# Altium project BMS Slave.PrjPcb
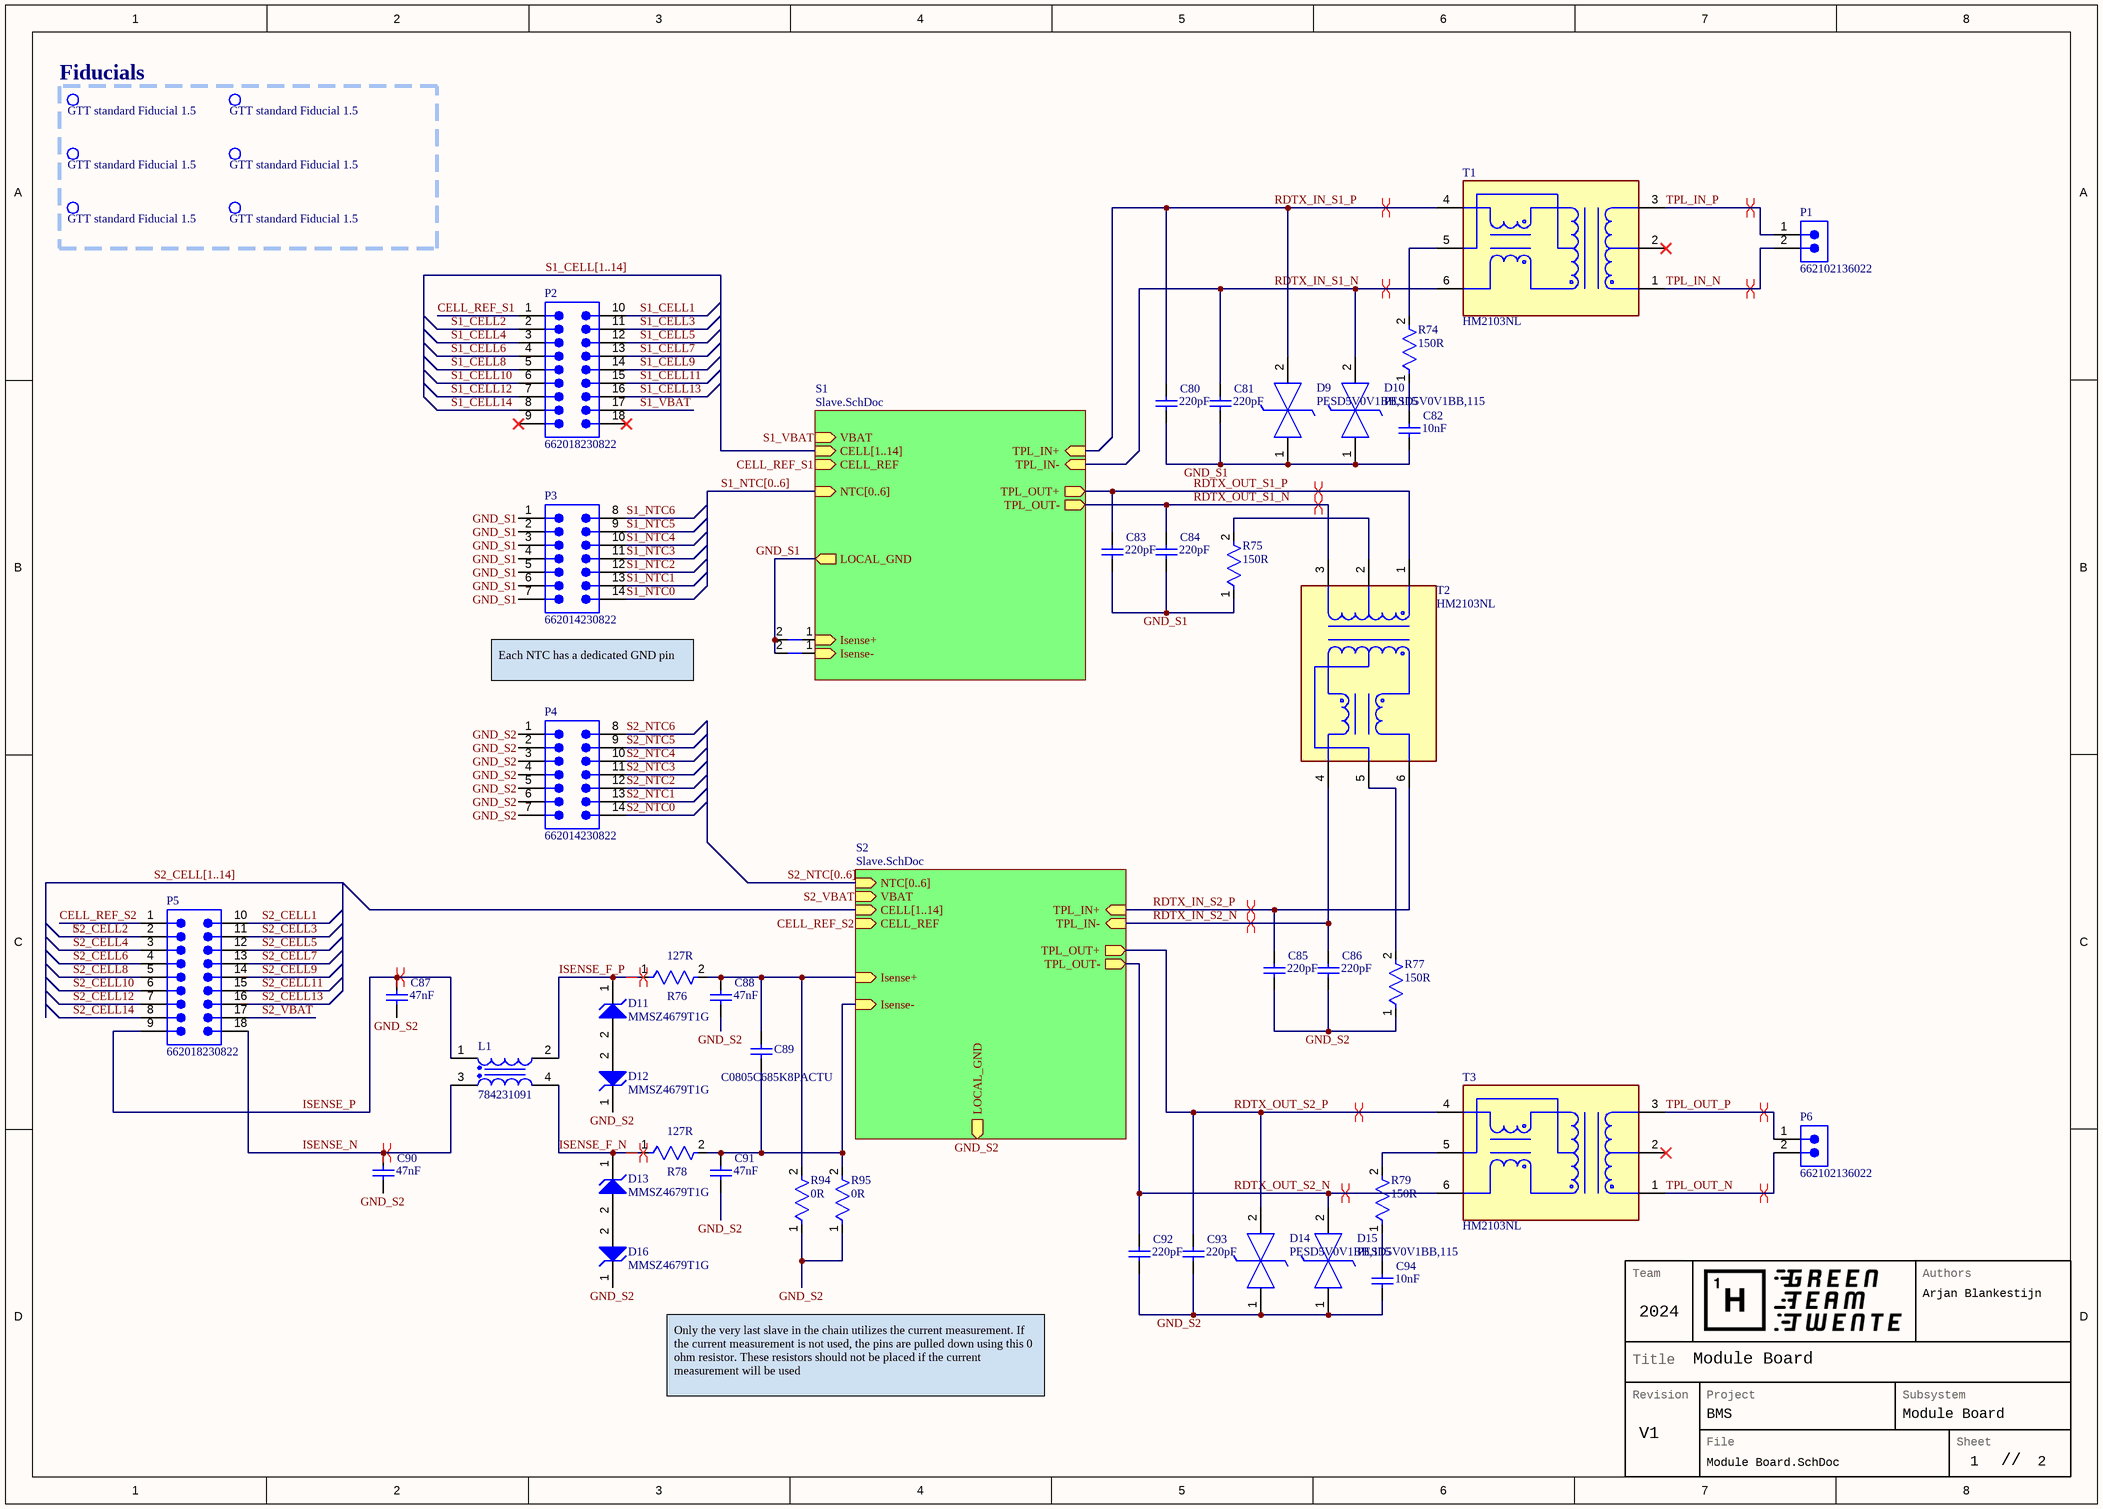
[diagram p0: Module Board.SchDoc]
2 sheets, 405 parts. Net scope: hierarchical (ports join the sheet entries above them; power ports are global).
Board file: Module Board.PcbDoc
Sheets:
  Module Board.SchDoc
    S1 = Slave.SchDoc
    S2 = Slave.SchDoc

## Sheet Module Board.SchDoc: Module Board
size A3; Author: Arjan Blankestijn; Revision: V1; SheetNumber: 1; SheetTotal: 2; Team: 2024; Subsystem: Module Board; ProjectPrettyName: BMS

### Parts
*1  GTT standard Fiducial 1.5  [Fiducial 1.5mm]  (no BOM)
*2  GTT standard Fiducial 1.5  [Fiducial 1.5mm]  (no BOM)
*3  GTT standard Fiducial 1.5  [Fiducial 1.5mm]  (no BOM)
*4  GTT standard Fiducial 1.5  [Fiducial 1.5mm]  (no BOM)
*5  GTT standard Fiducial 1.5  [Fiducial 1.5mm]  (no BOM)
*6  GTT standard Fiducial 1.5  [Fiducial 1.5mm]  (no BOM)
C80  value 220pF  [WCAP-CSGP_0402_L1W0.5H0.5]  (hidden comment: CAP 0402 220pF X7R)
C81  value 220pF  [WCAP-CSGP_0402_L1W0.5H0.5]  (hidden comment: CAP 0402 220pF X7R)
C82  value 10nF  [WCAP-CSGP_0402_L1W0.5H0.5]  (hidden comment: CAP 0402 10nF X7R)
C83  value 220pF  [WCAP-CSGP_0402_L1W0.5H0.5]  (hidden comment: CAP 0402 220pF X7R)
C84  value 220pF  [WCAP-CSGP_0402_L1W0.5H0.5]  (hidden comment: CAP 0402 220pF X7R)
C85  value 220pF  [WCAP-CSGP_0402_L1W0.5H0.5]  (hidden comment: CAP 0402 220pF X7R)
C86  value 220pF  [WCAP-CSGP_0402_L1W0.5H0.5]  (hidden comment: CAP 0402 220pF X7R)
C87  value 47nF  [WCAP-CSGP_0402_L1W0.5H0.5]  (hidden comment: CAP 0402 47nF X7R)
C88  value 47nF  [WCAP-CSGP_0402_L1W0.5H0.5]  (hidden comment: CAP 0402 47nF X7R)
C89  C0805C685K8PACTU  [CAPC2013X145X50NL20T25]
C90  value 47nF  [WCAP-CSGP_0402_L1W0.5H0.5]  (hidden comment: CAP 0402 47nF X7R)
C91  value 47nF  [WCAP-CSGP_0402_L1W0.5H0.5]  (hidden comment: CAP 0402 47nF X7R)
C92  value 220pF  [WCAP-CSGP_0402_L1W0.5H0.5]  (hidden comment: CAP 0402 220pF X7R)
C93  value 220pF  [WCAP-CSGP_0402_L1W0.5H0.5]  (hidden comment: CAP 0402 220pF X7R)
C94  value 10nF  [WCAP-CSGP_0402_L1W0.5H0.5]  (hidden comment: CAP 0402 10nF X7R)
D9  PESD5V0V1BB,115  [PESD5V0V1BB115]
D10  PESD5V0V1BB,115  [PESD5V0V1BB115]
D11  MMSZ4679T1G  [ONSC-SOD-123-2-425-04_V]
D12  MMSZ4679T1G  [ONSC-SOD-123-2-425-04_V]
D13  MMSZ4679T1G  [ONSC-SOD-123-2-425-04_V]
D14  PESD5V0V1BB,115  [PESD5V0V1BB115]
D15  PESD5V0V1BB,115  [PESD5V0V1BB115]
D16  MMSZ4679T1G  [ONSC-SOD-123-2-425-04_V]
L1  784231091  [WE-CNSA_0805]
NT1  Net Tie 0.2mm  [NETTIE_0.2mm]  (value not drawn)  (net tie, no BOM)
NT2  Net Tie 0.2mm  [NETTIE_0.2mm]  (value not drawn)  (net tie, no BOM)
P1  662102136022  [662102136022]
P2  662018230822  [662018230822]
P3  662014230822  [662014230822]
P4  662014230822  [662014230822]
P5  662018230822  [662018230822]
P6  662102136022  [662102136022]
R74  value 150R  [FP0402]  (hidden comment: RES 0402 150R 1%)
R75  value 150R  [FP0402]  (hidden comment: RES 0402 150R 1%)
R76  value 127R  [FP0402]  (hidden comment: RES 0402 127R 1%)
R77  value 150R  [FP0402]  (hidden comment: RES 0402 150R 1%)
R78  value 127R  [FP0402]  (hidden comment: RES 0402 127R 1%)
R79  value 150R  [FP0402]  (hidden comment: RES 0402 150R 1%)
R94  value 0R  [FP0402]  (hidden comment: RES 0402 0R 1%)
R95  value 0R  [FP0402]  (hidden comment: RES 0402 0R 1%)
T1  HM2103NL  [FP-HM2103NL-MFG]
T2  HM2103NL  [FP-HM2103NL-MFG]
T3  HM2103NL  [FP-HM2103NL-MFG]

### Blocks framed on the sheet
Fiducials: *1-*6

### Sub-sheets
S1 = Slave.SchDoc: CELL[1..14] (in), CELL_REF (in), LOCAL_GND (out), NTC[0..6] (in), TPL_IN+ (in), TPL_IN- (in), TPL_OUT+ (out), TPL_OUT- (out), Isense+ (in), Isense- (in), VBAT (in)
S2 = Slave.SchDoc: CELL[1..14] (in), CELL_REF (in), LOCAL_GND (out), NTC[0..6] (in), TPL_IN+ (in), TPL_IN- (in), TPL_OUT+ (out), TPL_OUT- (out), Isense+ (in), Isense- (in), VBAT (in)

### Nets
GND_S1: C80.1 C81.1 C82.1 C83.1 C84.1 C85.1 C86.1 C87.1 C88.1 C90.1 C91.1 C92.1 C93.1 C94.1 D9.1(K1) D10.1(K1) D12.1(K) D14.1(K1) D15.1(K1) D16.1(K) NT1.2 NT2.2 P3.1 P3.2 P3.3 P3.4 P3.5 P3.6 P3.7 P4.1 P4.2 P4.3 P4.4 P4.5 P4.6 P4.7 R75.1 R77.1 R94.1 R95.1 ; sheet S1/LOCAL_GND, sheet S2/LOCAL_GND  [also labelled GND_S2]
: P5.2  [also labelled S2_CELL2]
CELL_REF_S1: P2.1 ; sheet S1/CELL_REF  [project net CELL_REF]
CELL_REF_S2: P5.1 ; sheet S2/CELL_REF  [project net CELL_REF]
ISENSE_F_N: D13.1(K) L1.4 R78.1
ISENSE_F_P: D11.1(K) L1.2 R76.1
ISENSE_N: C90.2 L1.3 P5.18
ISENSE_P: C87.2 L1.1 P5.9
RDTX_IN_S1_N: C81.2 D10.2(K2) T1.6 ; sheet S1/TPL_IN-
RDTX_IN_S1_P: C80.2 D9.2(K2) T1.4 ; sheet S1/TPL_IN+
RDTX_IN_S2_N: C86.2 T2.4 ; sheet S2/TPL_IN-
RDTX_IN_S2_P: C85.2 T2.6 ; sheet S2/TPL_IN+
RDTX_OUT_S1_N: C84.2 T2.3 ; sheet S1/TPL_OUT-
RDTX_OUT_S1_P: C83.2 T2.1 ; sheet S1/TPL_OUT+
RDTX_OUT_S2_N: C92.2 D15.2(K2) T3.6 ; sheet S2/TPL_OUT-
RDTX_OUT_S2_P: C93.2 D14.2(K2) T3.4 ; sheet S2/TPL_OUT+
S1_CELL1: P2.10
S1_CELL2: P2.2
S1_CELL3: P2.11
S1_CELL4: P2.3
S1_CELL5: P2.12
S1_CELL6: P2.4
S1_CELL7: P2.13
S1_CELL8: P2.5
S1_CELL9: P2.14
S1_CELL10: P2.6
S1_CELL11: P2.15
S1_CELL12: P2.7
S1_CELL13: P2.16
S1_CELL14: P2.8
S1_NTC0: P3.14
S1_NTC1: P3.13
S1_NTC2: P3.12
S1_NTC3: P3.11
S1_NTC4: P3.10
S1_NTC5: P3.9
S1_NTC6: P3.8
S1_VBAT: P2.17 ; sheet S1/VBAT
S2_CELL1: P5.10
S2_CELL3: P5.11
S2_CELL4: P5.3
S2_CELL5: P5.12
S2_CELL6: P5.4
S2_CELL7: P5.13
S2_CELL8: P5.5
S2_CELL9: P5.14
S2_CELL10: P5.6
S2_CELL11: P5.15
S2_CELL12: P5.7
S2_CELL13: P5.16
S2_CELL14: P5.8
S2_NTC0: P4.14
S2_NTC1: P4.13
S2_NTC2: P4.12
S2_NTC3: P4.11
S2_NTC4: P4.10
S2_NTC5: P4.9
S2_NTC6: P4.8
S2_VBAT: P5.17 ; sheet S2/VBAT
TPL_IN_N: P1.2 T1.1
TPL_IN_P: P1.1 T1.3
TPL_OUT_N: P6.2 T3.1
TPL_OUT_P: P6.1 T3.3
NetC82_2: C82.2 R74.1
NetC88_2: C88.2 C89.2 R76.2 R94.2 ; sheet S2/Isense+
NetC89_1: C89.1 C91.2 R78.2 R95.2 ; sheet S2/Isense-
NetC94_2: C94.2 R79.1
NetD11_2: D11.2(A) D12.2(A)
NetD13_2: D13.2(A) D16.2(A)
NetIC1_S1_56: NT1.1 ; sheet S1/Isense+
NetIC1_S1_57: NT2.1 ; sheet S1/Isense-
NetR74_2: R74.2 T1.5
NetR75_2: R75.2 T2.2
NetR77_2: R77.2 T2.5
NetR79_2: R79.2 T3.5

Not connected (* = marked no-connect by the designer): P2 9* 18*; T1 2*; T3 2*

### Buses and harness runs
bus S1_CELL[1..14] = sheet S1/CELL[1..14]
bus S1_NTC[0..6] = sheet S1/NTC[0..6]
bus S2_CELL[1..14] = sheet S2/CELL[1..14]
bus S2_NTC[0..6] = sheet S2/NTC[0..6]

### Layout directives
differential pair; differential pair class TPL100; rule Clearance Constraint [Generic clearance = 0.15mm, and 12 value(s) for objects]: RDTX_IN_S1_N, RDTX_IN_S1_P, RDTX_IN_S2_N, RDTX_IN_S2_P, RDTX_OUT_S1_N, RDTX_OUT_S1_P, RDTX_OUT_S2_N, RDTX_OUT_S2_P, TPL_IN_N, TPL_IN_P, TPL_OUT_N, TPL_OUT_P
differential pair: ISENSE_F_N, ISENSE_F_P, ISENSE_N, ISENSE_P

### Notes on the sheet
- Each NTC has a dedicated GND pin
- Only the very last slave in the chain utilizes the current measurement. If the current measurement is not used, the pins are pulled down using this 0 ohm resistor. These resistors should not be placed if the current measurement will be used
- Team
- Authors
- Revision
- Title
- Project
- Subsystem
- File
- Sheet
- //

### Library data of the parts
*1-*6 = CMP-00028-00005-4: Fiducial 1.5; Pins: 0
C80-C88 C90-C94 = CMP-001-01308-5: GTT Standard 0402 non-polarized capacitor; Pins: 2; Case/Package: 0402; Category: Multilayer Ceramic Chip Capacitors; Ceramic Type: X7R
C89 = CMP-1036-04909-2: 6.8uF 0804; Manufacturer: Kemet; Part Number: C0805C685K8PACTU
D9 D10 D14 D15 = CMP-004-00097-1: PESD5V0V1BB - Very low capacitance bidirectional ESD protection diode; Manufacturer_Name: Nexperia; Arrow Price/Stock: https://www.arrow.com/en/products/pesd5v0v1bb115/nexperia?region=nac; Design Item ID: PESD5V0V1BB,115; Height: 0.65mm; Manufacturer_Part_Number: PESD5V0V1BB,115; Mouser Price/Stock: https://www.mouser.co.uk/ProductDetail/Nexperia/PESD5V0V1BB115?qs=GcY6OjH1zdkfLKV5vNnV%252BA%3D%3D; Datasheet Link: https://assets.nexperia.com/documents/data-sheet/PESD5V0V1BB.pdf; Mouser Part Number: 771-PESD5V0V1BB115; Source: TempSchematics.schlib; Arrow Part Number: PESD5V0V1BB,115
D11-D13 D16 = CMP-1060-00509-1: Zener Voltage Regulator, 500 mW, 2-Pin SOD-123, Pb-Free, Tape and Reel; Manufacturer: On Semiconductor; P Max (W): 0.5; VZ Typ (V): 2; Packing: Tape and Reel; ComponentLink1Description: Manufacturer URL; DatasheetVersion: Rev. 9; PackageReference: SOD-123-2-425-04; ComponentLink3URL: http://www.onsemi.com/pub_link/Collateral/425-04.PDF; PackageDescription: 2-Pin SOD, Body 1.6 x 2.69 mm; ComponentLink3Description: Package Specification; ComponentLink2Description: Datasheet; ComponentLink1URL: http://www.onsemi.com/; PartNumber: MMSZ4679T1G; RoHS: Pb-Free; PackageVersion: Rev. G, 10/2009; ComponentLink2URL: http://www.onsemi.com/pub_link/Collateral/MMSZ4678T1-D.PDF; Mounting Technology: Surface Mount
L1 = CMP-00030-00004-1: Common Mode Filter, Aec-Q200, 131Nh/0.37A Rohs Compliant: Yes
NT1 NT2 = CMP-009-00202-2
P1 P6 = CMP-1502-00472-2: NexarPartId: 71472447; Operating Supply Voltage: 250V; Insulation Resistance: 1GΩ; Contact Resistance: 10mΩ; Number of Positions: 2; Pitch: 3mm; Gender: Male; Connector Type: Male Pin; Current Rating: 5A; Lead Pitch: 3mm; Number of Pins: 2; Fastening Type: Ramp; Color: Black; Packaging: Tape and Reel; Mount: Surface Mount; Length: 9.65mm; Contact Plating: Tin; Max Operating Temperature: 105°C; RoHS: Compliant; Min Operating Temperature: -40°C; Number of Rows: 1; Termination: Solder
P2 P5 = CMP-1502-00404-2: NexarPartId: 23024748; Contact Resistance: 10mΩ; Pitch: 3mm; Number of Positions: 18; Insulation Resistance: 1GΩ; Gender: Male; Connector Type: Male Pin, Socket; Operating Supply Voltage: 250V; Current Rating: 5A; Row Spacing: 2.9972mm; RoHS: Compliant; Color: Black; Height: 11.36mm; REACH SVHC: Unknown; Contact Plating: Tin; Contact Material: Copper; Width: 30.7mm; Length: 30.7mm; Mount: Surface Mount; Termination: Solder; Max Operating Temperature: 105°C; Number of Pins: 18; Min Operating Temperature: -40°C; Lead Pitch: 3mm; Fastening Type: Ramp; Number of Rows: 2; Number of Contacts: 18
P3 P4 = CMP-1502-00402-2: NexarPartId: 23024730; Contact Resistance: 10mΩ; Connector Type: Male Pin, Socket; Gender: Male; Number of Contacts: 14; Operating Supply Voltage: 250V; Current Rating: 5A; Insulation Resistance: 1GΩ; Pitch: 3mm; Row Spacing: 2.9972mm; Height: 11.36mm; Color: Black; Contact Plating: Tin; Lead Pitch: 3mm; Number of Positions: 14; Number of Rows: 2; Min Operating Temperature: -40°C; Contact Material: Copper; Termination: Solder; REACH SVHC: Unknown; Number of Pins: 14; Max Operating Temperature: 105°C; Mount: Surface Mount; RoHS: Compliant; Fastening Type: Ramp; Length: 24.7mm; Width: 24.7mm
R74-R79 R94 R95 = CMP-009-00204-16: GTT Standard 0402 Resistor; Voltage Rating: 50V; Power: 62.5mW; Case/Package: 0402; Mounting Technology: SMD; Design Item ID: RES 0402; Source: Passives.SchLib; Tolerance: 1%
T1-T3 = CMP-16309-000039-1: XFMR CMC MODULE AECQ BATT MNGT; Obsolete Part: false; Manufacturer: Pulse; Isolation Voltage: 4300VDC; Automotive Grade: Grade 1; Turns Ratio: 1:1; Standoff Height: 0.13mm; Insertion Loss: 0.25dB; Return Loss: 20dB; Inductance Primary: 150uH; Device Class L2: Transformers; Automotive: Yes; RoHS: TRUE; Device Class L1: Passive Components; Digikey Description: XFMR CMC MODULE AECQ BATT MNGT; Package: 0; Manufacturer Part Number: HM2103NL; Height: 5.72mm; Temperature Range High: +125°C; Temperature Range Low: -40°C; Category: Trans; Temperature: -40°C to +125°C; Lead Free: Yes; ComponentLink2URL: https://productfinder.pulseeng.com/product/HM2103NL; Octopart: https://octopart.com/hm2103nl-pulse-87646222; Device Class L3: unset; ComponentLink2Description: Datasheet

## Sheet Slave.SchDoc: Slave
size A3; Author: Arjan Blankestijn; Revision: V1; SheetNumber: 2; SheetTotal: 2; Author2: Bram Bremer; Team: 2024; ProjectPrettyName: BMS; Subsystem: Module Board
Used 2 times, as channels S1, S2. Parts and nets are listed once, with the designators drawn on the sheet.
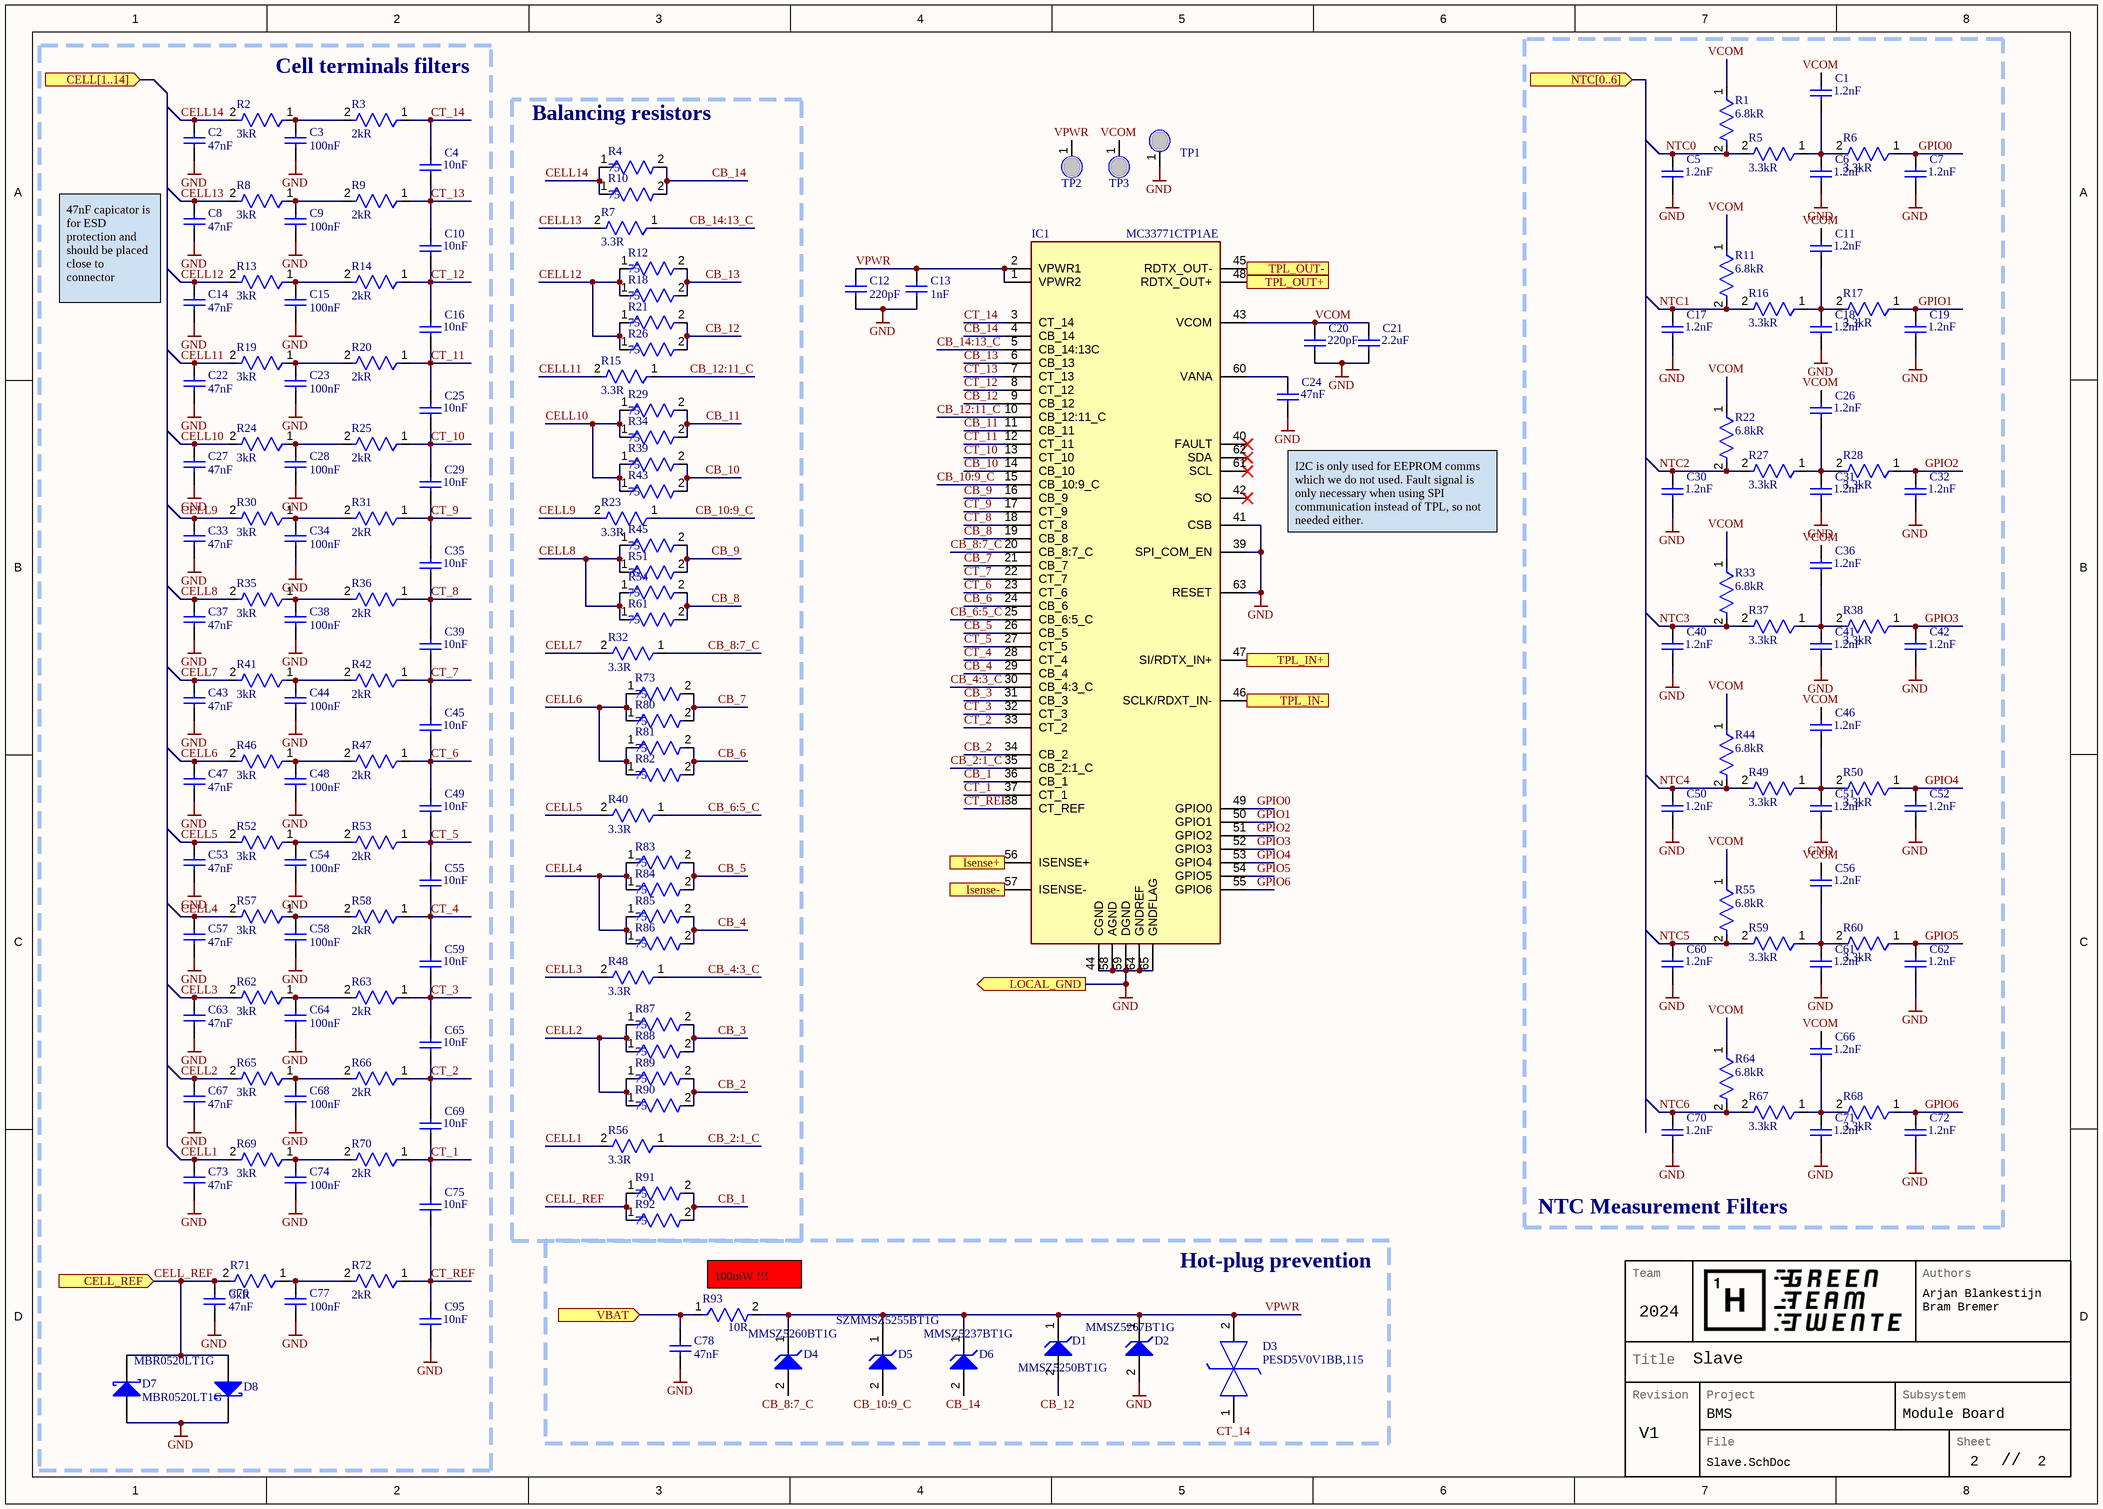
[diagram p1: Slave.SchDoc]

### Parts
C1  value 1.2nF  [WCAP-CSGP_0402_L1W0.5H0.5]  (hidden comment: CAP 0402 1.2nF X7R)
C2  value 47nF  [WCAP-CSGP_0603_L1.6W0.8H0.8_Reflow]  (hidden comment: CAP 0603 47nF X7R)
C3  value 100nF  [WCAP-CSGP_0603_L1.6W0.8H0.8_Reflow]  (hidden comment: CAP 0603 100nF X7R)
C4  value 10nF  [WCAP-CSGP_0402_L1W0.5H0.5]  (hidden comment: CAP 0402 10nF X7R)
C5  value 1.2nF  [WCAP-CSGP_0402_L1W0.5H0.5]  (hidden comment: CAP 0402 1.2nF X7R)
C6  value 1.2nF  [WCAP-CSGP_0402_L1W0.5H0.5]  (hidden comment: CAP 0402 1.2nF X7R)
C7  value 1.2nF  [WCAP-CSGP_0402_L1W0.5H0.5]  (hidden comment: CAP 0402 1.2nF X7R)
C8  value 47nF  [WCAP-CSGP_0603_L1.6W0.8H0.8_Reflow]  (hidden comment: CAP 0603 47nF X7R)
C9  value 100nF  [WCAP-CSGP_0603_L1.6W0.8H0.8_Reflow]  (hidden comment: CAP 0603 100nF X7R)
C10  value 10nF  [WCAP-CSGP_0402_L1W0.5H0.5]  (hidden comment: CAP 0402 10nF X7R)
C11  value 1.2nF  [WCAP-CSGP_0402_L1W0.5H0.5]  (hidden comment: CAP 0402 1.2nF X7R)
C12  value 220pF  [WCAP-CSGP_0603_L1.6W0.8H0.8_Reflow]  (hidden comment: CAP 0603 220pF X7R)
C13  value 1nF  [WCAP-CSGP_0603_L1.6W0.8H0.8_Reflow]  (hidden comment: CAP 0603 1nF X7R)
C14  value 47nF  [WCAP-CSGP_0603_L1.6W0.8H0.8_Reflow]  (hidden comment: CAP 0603 47nF X7R)
C15  value 100nF  [WCAP-CSGP_0603_L1.6W0.8H0.8_Reflow]  (hidden comment: CAP 0603 100nF X7R)
C16  value 10nF  [WCAP-CSGP_0402_L1W0.5H0.5]  (hidden comment: CAP 0402 10nF X7R)
C17  value 1.2nF  [WCAP-CSGP_0402_L1W0.5H0.5]  (hidden comment: CAP 0402 1.2nF X7R)
C18  value 1.2nF  [WCAP-CSGP_0402_L1W0.5H0.5]  (hidden comment: CAP 0402 1.2nF X7R)
C19  value 1.2nF  [WCAP-CSGP_0402_L1W0.5H0.5]  (hidden comment: CAP 0402 1.2nF X7R)
C20  value 220pF  [WCAP-CSGP_0402_L1W0.5H0.5]  (hidden comment: CAP 0402 220pF X7R)
C21  value 2.2uF  [WCAP-CSGP_0402_L1W0.5H0.5]  (hidden comment: CAP 0402 2.2uF X7R)
C22  value 47nF  [WCAP-CSGP_0603_L1.6W0.8H0.8_Reflow]  (hidden comment: CAP 0603 47nF X7R)
C23  value 100nF  [WCAP-CSGP_0603_L1.6W0.8H0.8_Reflow]  (hidden comment: CAP 0603 100nF X7R)
C24  value 47nF  [WCAP-CSGP_0402_L1W0.5H0.5]  (hidden comment: CAP 0402 47nF X7R)
C25  value 10nF  [WCAP-CSGP_0402_L1W0.5H0.5]  (hidden comment: CAP 0402 10nF X7R)
C26  value 1.2nF  [WCAP-CSGP_0402_L1W0.5H0.5]  (hidden comment: CAP 0402 1.2nF X7R)
C27  value 47nF  [WCAP-CSGP_0603_L1.6W0.8H0.8_Reflow]  (hidden comment: CAP 0603 47nF X7R)
C28  value 100nF  [WCAP-CSGP_0603_L1.6W0.8H0.8_Reflow]  (hidden comment: CAP 0603 100nF X7R)
C29  value 10nF  [WCAP-CSGP_0402_L1W0.5H0.5]  (hidden comment: CAP 0402 10nF X7R)
C30  value 1.2nF  [WCAP-CSGP_0402_L1W0.5H0.5]  (hidden comment: CAP 0402 1.2nF X7R)
C31  value 1.2nF  [WCAP-CSGP_0402_L1W0.5H0.5]  (hidden comment: CAP 0402 1.2nF X7R)
C32  value 1.2nF  [WCAP-CSGP_0402_L1W0.5H0.5]  (hidden comment: CAP 0402 1.2nF X7R)
C33  value 47nF  [WCAP-CSGP_0603_L1.6W0.8H0.8_Reflow]  (hidden comment: CAP 0603 47nF X7R)
C34  value 100nF  [WCAP-CSGP_0603_L1.6W0.8H0.8_Reflow]  (hidden comment: CAP 0603 100nF X7R)
C35  value 10nF  [WCAP-CSGP_0402_L1W0.5H0.5]  (hidden comment: CAP 0402 10nF X7R)
C36  value 1.2nF  [WCAP-CSGP_0402_L1W0.5H0.5]  (hidden comment: CAP 0402 1.2nF X7R)
C37  value 47nF  [WCAP-CSGP_0603_L1.6W0.8H0.8_Reflow]  (hidden comment: CAP 0603 47nF X7R)
C38  value 100nF  [WCAP-CSGP_0603_L1.6W0.8H0.8_Reflow]  (hidden comment: CAP 0603 100nF X7R)
C39  value 10nF  [WCAP-CSGP_0402_L1W0.5H0.5]  (hidden comment: CAP 0402 10nF X7R)
C40  value 1.2nF  [WCAP-CSGP_0402_L1W0.5H0.5]  (hidden comment: CAP 0402 1.2nF X7R)
C41  value 1.2nF  [WCAP-CSGP_0402_L1W0.5H0.5]  (hidden comment: CAP 0402 1.2nF X7R)
C42  value 1.2nF  [WCAP-CSGP_0402_L1W0.5H0.5]  (hidden comment: CAP 0402 1.2nF X7R)
C43  value 47nF  [WCAP-CSGP_0603_L1.6W0.8H0.8_Reflow]  (hidden comment: CAP 0603 47nF X7R)
C44  value 100nF  [WCAP-CSGP_0603_L1.6W0.8H0.8_Reflow]  (hidden comment: CAP 0603 100nF X7R)
C45  value 10nF  [WCAP-CSGP_0402_L1W0.5H0.5]  (hidden comment: CAP 0402 10nF X7R)
C46  value 1.2nF  [WCAP-CSGP_0402_L1W0.5H0.5]  (hidden comment: CAP 0402 1.2nF X7R)
C47  value 47nF  [WCAP-CSGP_0603_L1.6W0.8H0.8_Reflow]  (hidden comment: CAP 0603 47nF X7R)
C48  value 100nF  [WCAP-CSGP_0603_L1.6W0.8H0.8_Reflow]  (hidden comment: CAP 0603 100nF X7R)
C49  value 10nF  [WCAP-CSGP_0402_L1W0.5H0.5]  (hidden comment: CAP 0402 10nF X7R)
C50  value 1.2nF  [WCAP-CSGP_0402_L1W0.5H0.5]  (hidden comment: CAP 0402 1.2nF X7R)
C51  value 1.2nF  [WCAP-CSGP_0402_L1W0.5H0.5]  (hidden comment: CAP 0402 1.2nF X7R)
C52  value 1.2nF  [WCAP-CSGP_0402_L1W0.5H0.5]  (hidden comment: CAP 0402 1.2nF X7R)
C53  value 47nF  [WCAP-CSGP_0603_L1.6W0.8H0.8_Reflow]  (hidden comment: CAP 0603 47nF X7R)
C54  value 100nF  [WCAP-CSGP_0603_L1.6W0.8H0.8_Reflow]  (hidden comment: CAP 0603 100nF X7R)
C55  value 10nF  [WCAP-CSGP_0402_L1W0.5H0.5]  (hidden comment: CAP 0402 10nF X7R)
C56  value 1.2nF  [WCAP-CSGP_0402_L1W0.5H0.5]  (hidden comment: CAP 0402 1.2nF X7R)
C57  value 47nF  [WCAP-CSGP_0603_L1.6W0.8H0.8_Reflow]  (hidden comment: CAP 0603 47nF X7R)
C58  value 100nF  [WCAP-CSGP_0603_L1.6W0.8H0.8_Reflow]  (hidden comment: CAP 0603 100nF X7R)
C59  value 10nF  [WCAP-CSGP_0402_L1W0.5H0.5]  (hidden comment: CAP 0402 10nF X7R)
C60  value 1.2nF  [WCAP-CSGP_0402_L1W0.5H0.5]  (hidden comment: CAP 0402 1.2nF X7R)
C61  value 1.2nF  [WCAP-CSGP_0402_L1W0.5H0.5]  (hidden comment: CAP 0402 1.2nF X7R)
C62  value 1.2nF  [WCAP-CSGP_0402_L1W0.5H0.5]  (hidden comment: CAP 0402 1.2nF X7R)
C63  value 47nF  [WCAP-CSGP_0603_L1.6W0.8H0.8_Reflow]  (hidden comment: CAP 0603 47nF X7R)
C64  value 100nF  [WCAP-CSGP_0603_L1.6W0.8H0.8_Reflow]  (hidden comment: CAP 0603 100nF X7R)
C65  value 10nF  [WCAP-CSGP_0402_L1W0.5H0.5]  (hidden comment: CAP 0402 10nF X7R)
C66  value 1.2nF  [WCAP-CSGP_0402_L1W0.5H0.5]  (hidden comment: CAP 0402 1.2nF X7R)
C67  value 47nF  [WCAP-CSGP_0603_L1.6W0.8H0.8_Reflow]  (hidden comment: CAP 0603 47nF X7R)
C68  value 100nF  [WCAP-CSGP_0603_L1.6W0.8H0.8_Reflow]  (hidden comment: CAP 0603 100nF X7R)
C69  value 10nF  [WCAP-CSGP_0402_L1W0.5H0.5]  (hidden comment: CAP 0402 10nF X7R)
C70  value 1.2nF  [WCAP-CSGP_0402_L1W0.5H0.5]  (hidden comment: CAP 0402 1.2nF X7R)
C71  value 1.2nF  [WCAP-CSGP_0402_L1W0.5H0.5]  (hidden comment: CAP 0402 1.2nF X7R)
C72  value 1.2nF  [WCAP-CSGP_0402_L1W0.5H0.5]  (hidden comment: CAP 0402 1.2nF X7R)
C73  value 47nF  [WCAP-CSGP_0603_L1.6W0.8H0.8_Reflow]  (hidden comment: CAP 0603 47nF X7R)
C74  value 100nF  [WCAP-CSGP_0603_L1.6W0.8H0.8_Reflow]  (hidden comment: CAP 0603 100nF X7R)
C75  value 10nF  [WCAP-CSGP_0402_L1W0.5H0.5]  (hidden comment: CAP 0402 10nF X7R)
C76  value 47nF  [WCAP-CSGP_0603_L1.6W0.8H0.8_Reflow]  (hidden comment: CAP 0603 47nF X7R)
C77  value 100nF  [WCAP-CSGP_0603_L1.6W0.8H0.8_Reflow]  (hidden comment: CAP 0603 100nF X7R)
C78  value 47nF  [WCAP-CSGP_0603_L1.6W0.8H0.8_Reflow]  (hidden comment: CAP 0603 47nF X7R)
C95  value 10nF  [WCAP-CSGP_0402_L1W0.5H0.5]  (hidden comment: CAP 0402 10nF X7R)
D1  MMSZ5250BT1G  [ONSC-SOD-123-2-425-04_V]
D2  MMSZ5267BT1G  [ONSC-SOD-123-2-425-04_V]
D3  PESD5V0V1BB,115  [PESD5V0V1BB115]
D4  MMSZ5260BT1G  [ONSC-SOD-123-2-425-04_V]
D5  SZMMSZ5255BT1G  [ONSC-SOD-123-2-425-04_V]
D6  MMSZ5237BT1G  [ONSC-SOD-123-2-425-04_V]
D7  MBR0520LT1G  [ONSC-SOD-123-2-425-04_V]
D8  MBR0520LT1G  [ONSC-SOD-123-2-425-04_V]
IC1  MC33771CTP1AE  [QFP50P1200X1200X160-65N]
R1  value 6.8kR  [FP0402]  (hidden comment: RES 0402 6.8kR 1%)
R2  value 3kR  [FP0402]  (hidden comment: RES 0402 3kR 1%)
R3  value 2kR  [FP0402]  (hidden comment: RES 0402 2kR 1%)
R4  value 75  [RES_SM1206_YAGEORC_N]  (hidden comment: RES 1206 75 1%)
R5  value 3.3kR  [FP0402]  (hidden comment: RES 0402 3.3kR 1%)
R6  value 3.3kR  [FP0402]  (hidden comment: RES 0402 3.3kR 1%)
R7  value 3.3R  [FP0402]  (hidden comment: RES 0402 3.3R 1%)
R8  value 3kR  [FP0402]  (hidden comment: RES 0402 3kR 1%)
R9  value 2kR  [FP0402]  (hidden comment: RES 0402 2kR 1%)
R10  value 75  [RES_SM1206_YAGEORC_N]  (hidden comment: RES 1206 75 1%)
R11  value 6.8kR  [FP0402]  (hidden comment: RES 0402 6.8kR 1%)
R12  value 75  [RES_SM1206_YAGEORC_N]  (hidden comment: RES 1206 75 1%)
R13  value 3kR  [FP0402]  (hidden comment: RES 0402 3kR 1%)
R14  value 2kR  [FP0402]  (hidden comment: RES 0402 2kR 1%)
R15  value 3.3R  [FP0402]  (hidden comment: RES 0402 3.3R 1%)
R16  value 3.3kR  [FP0402]  (hidden comment: RES 0402 3.3kR 1%)
R17  value 3.3kR  [FP0402]  (hidden comment: RES 0402 3.3kR 1%)
R18  value 75  [RES_SM1206_YAGEORC_N]  (hidden comment: RES 1206 75 1%)
R19  value 3kR  [FP0402]  (hidden comment: RES 0402 3kR 1%)
R20  value 2kR  [FP0402]  (hidden comment: RES 0402 2kR 1%)
R21  value 75  [RES_SM1206_YAGEORC_N]  (hidden comment: RES 1206 75 1%)
R22  value 6.8kR  [FP0402]  (hidden comment: RES 0402 6.8kR 1%)
R23  value 3.3R  [FP0402]  (hidden comment: RES 0402 3.3R 1%)
R24  value 3kR  [FP0402]  (hidden comment: RES 0402 3kR 1%)
R25  value 2kR  [FP0402]  (hidden comment: RES 0402 2kR 1%)
R26  value 75  [RES_SM1206_YAGEORC_N]  (hidden comment: RES 1206 75 1%)
R27  value 3.3kR  [FP0402]  (hidden comment: RES 0402 3.3kR 1%)
R28  value 3.3kR  [FP0402]  (hidden comment: RES 0402 3.3kR 1%)
R29  value 75  [RES_SM1206_YAGEORC_N]  (hidden comment: RES 1206 75 1%)
R30  value 3kR  [FP0402]  (hidden comment: RES 0402 3kR 1%)
R31  value 2kR  [FP0402]  (hidden comment: RES 0402 2kR 1%)
R32  value 3.3R  [FP0402]  (hidden comment: RES 0402 3.3R 1%)
R33  value 6.8kR  [FP0402]  (hidden comment: RES 0402 6.8kR 1%)
R34  value 75  [RES_SM1206_YAGEORC_N]  (hidden comment: RES 1206 75 1%)
R35  value 3kR  [FP0402]  (hidden comment: RES 0402 3kR 1%)
R36  value 2kR  [FP0402]  (hidden comment: RES 0402 2kR 1%)
R37  value 3.3kR  [FP0402]  (hidden comment: RES 0402 3.3kR 1%)
R38  value 3.3kR  [FP0402]  (hidden comment: RES 0402 3.3kR 1%)
R39  value 75  [RES_SM1206_YAGEORC_N]  (hidden comment: RES 1206 75 1%)
R40  value 3.3R  [FP0402]  (hidden comment: RES 0402 3.3R 1%)
R41  value 3kR  [FP0402]  (hidden comment: RES 0402 3kR 1%)
R42  value 2kR  [FP0402]  (hidden comment: RES 0402 2kR 1%)
R43  value 75  [RES_SM1206_YAGEORC_N]  (hidden comment: RES 1206 75 1%)
R44  value 6.8kR  [FP0402]  (hidden comment: RES 0402 6.8kR 1%)
R45  value 75  [RES_SM1206_YAGEORC_N]  (hidden comment: RES 1206 75 1%)
R46  value 3kR  [FP0402]  (hidden comment: RES 0402 3kR 1%)
R47  value 2kR  [FP0402]  (hidden comment: RES 0402 2kR 1%)
R48  value 3.3R  [FP0402]  (hidden comment: RES 0402 3.3R 1%)
R49  value 3.3kR  [FP0402]  (hidden comment: RES 0402 3.3kR 1%)
R50  value 3.3kR  [FP0402]  (hidden comment: RES 0402 3.3kR 1%)
R51  value 75  [RES_SM1206_YAGEORC_N]  (hidden comment: RES 1206 75 1%)
R52  value 3kR  [FP0402]  (hidden comment: RES 0402 3kR 1%)
R53  value 2kR  [FP0402]  (hidden comment: RES 0402 2kR 1%)
R54  value 75  [RES_SM1206_YAGEORC_N]  (hidden comment: RES 1206 75 1%)
R55  value 6.8kR  [FP0402]  (hidden comment: RES 0402 6.8kR 1%)
R56  value 3.3R  [FP0402]  (hidden comment: RES 0402 3.3R 1%)
R57  value 3kR  [FP0402]  (hidden comment: RES 0402 3kR 1%)
R58  value 2kR  [FP0402]  (hidden comment: RES 0402 2kR 1%)
R59  value 3.3kR  [FP0402]  (hidden comment: RES 0402 3.3kR 1%)
R60  value 3.3kR  [FP0402]  (hidden comment: RES 0402 3.3kR 1%)
R61  value 75  [RES_SM1206_YAGEORC_N]  (hidden comment: RES 1206 75 1%)
R62  value 3kR  [FP0402]  (hidden comment: RES 0402 3kR 1%)
R63  value 2kR  [FP0402]  (hidden comment: RES 0402 2kR 1%)
R64  value 6.8kR  [FP0402]  (hidden comment: RES 0402 6.8kR 1%)
R65  value 3kR  [FP0402]  (hidden comment: RES 0402 3kR 1%)
R66  value 2kR  [FP0402]  (hidden comment: RES 0402 2kR 1%)
R67  value 3.3kR  [FP0402]  (hidden comment: RES 0402 3.3kR 1%)
R68  value 3.3kR  [FP0402]  (hidden comment: RES 0402 3.3kR 1%)
R69  value 3kR  [FP0402]  (hidden comment: RES 0402 3kR 1%)
R70  value 2kR  [FP0402]  (hidden comment: RES 0402 2kR 1%)
R71  value 3kR  [FP0402]  (hidden comment: RES 0402 3kR 1%)
R72  value 2kR  [FP0402]  (hidden comment: RES 0402 2kR 1%)
R73  value 75  [RES_SM1206_YAGEORC_N]  (hidden comment: RES 1206 75 1%)
R80  value 75  [RES_SM1206_YAGEORC_N]  (hidden comment: RES 1206 75 1%)
R81  value 75  [RES_SM1206_YAGEORC_N]  (hidden comment: RES 1206 75 1%)
R82  value 75  [RES_SM1206_YAGEORC_N]  (hidden comment: RES 1206 75 1%)
R83  value 75  [RES_SM1206_YAGEORC_N]  (hidden comment: RES 1206 75 1%)
R84  value 75  [RES_SM1206_YAGEORC_N]  (hidden comment: RES 1206 75 1%)
R85  value 75  [RES_SM1206_YAGEORC_N]  (hidden comment: RES 1206 75 1%)
R86  value 75  [RES_SM1206_YAGEORC_N]  (hidden comment: RES 1206 75 1%)
R87  value 75  [RES_SM1206_YAGEORC_N]  (hidden comment: RES 1206 75 1%)
R88  value 75  [RES_SM1206_YAGEORC_N]  (hidden comment: RES 1206 75 1%)
R89  value 75  [RES_SM1206_YAGEORC_N]  (hidden comment: RES 1206 75 1%)
R90  value 75  [RES_SM1206_YAGEORC_N]  (hidden comment: RES 1206 75 1%)
R91  value 75  [RES_SM1206_YAGEORC_N]  (hidden comment: RES 1206 75 1%)
R92  value 75  [RES_SM1206_YAGEORC_N]  (hidden comment: RES 1206 75 1%)
R93  value 10R  [RES_SM1206_YAGEORC_N]  (hidden comment: RES 1206 10R 1%)
TP1  GTT_ProbeerPunt  [GTT_ProbeerPuntFP]  (value not drawn)  (no BOM)
TP2  GTT_ProbeerPunt  [GTT_ProbeerPuntFP]  (value not drawn)  (no BOM)
TP3  GTT_ProbeerPunt  [GTT_ProbeerPuntFP]  (value not drawn)  (no BOM)

### Blocks framed on the sheet
Cell terminals filters: C2-C4 C8-C10 C14-C16 C22 C23 C25 C27-C29 C33-C35 C37-C39 C43-C45 C47-C49 C53-C55 C57-C59 C63-C65 C67-C69 C73-C77 C95 D7 D8 R2 R3 R8 R9 R13 R14 R19 R20 R24 R25 R30 R31 R35 R36 R41 R42 R46 R47 R52 R53 R57 R58 R62 R63 R65 R66 R69-R72
NTC Measurement Filters: C1 C5-C7 C11 C17-C19 C26 C30-C32 C36 C40-C42 C46 C50-C52 C56 C60-C62 C66 C70-C72 R1 R5 R6 R11 R16 R17 R22 R27 R28 R33 R37 R38 R44 R49 R50 R55 R59 R60 R64 R67 R68
Balancing resistors: R4 R7 R10 R12 R15 R18 R21 R23 R26 R29 R32 R34 R39 R40 R43 R45 R48 R51 R54 R56 R61 R73 R80-R92
Hot-plug prevention: C78 D1-D6 R93

### Ports
CELL[1..14] (in), CELL_REF (in), Isense+ (in), Isense- (in), LOCAL_GND (out), NTC[0..6] (in), TPL_IN+ (in), TPL_IN- (in), TPL_OUT+ (out), TPL_OUT- (out), VBAT (in)

### Nets
GND: C2.1 C3.1 C5.1 C6.1 C7.1 C8.1 C9.1 C12.1 C13.1 C14.1 C15.1 C17.1 C18.1 C19.1 C20.1 C21.1 C22.1 C23.1 C24.1 C27.1 C28.1 C30.1 C31.1 C32.1 C33.1 C34.1 C37.1 C38.1 C40.1 C41.1 C42.1 C43.1 C44.1 C47.1 C48.1 C50.1 C51.1 C52.1 C53.1 C54.1 C57.1 C58.1 C60.1 C61.1 C62.1 C63.1 C64.1 C67.1 C68.1 C70.1 C71.1 C72.1 C73.1 C74.1 C76.1 C77.1 C78.1 C95.1 D2.2(A) D7.1(A) D8.2(K) IC1.39(SPI_COM_EN) IC1.41(CSB) IC1.44(CGND) IC1.58(AGND) IC1.59(DGND) IC1.63(RESET) IC1.64(GNDREF) IC1.65(GNDFLAG) TP1.1 ; port LOCAL_GND
CB_1: IC1.36(CB_1) R91.2 R92.2
CB_2: IC1.34(CB_2) R89.2 R90.2
CB_2:1_C: IC1.35(CB_2:1_C) R56.1
CB_3: IC1.31(CB_3) R87.2 R88.2
CB_4: IC1.29(CB_4) R85.2 R86.2
CB_4:3_C: IC1.30(CB_4:3_C) R48.1
CB_5: IC1.26(CB_5) R83.2 R84.2
CB_6: IC1.24(CB_6) R81.2 R82.2
CB_6:5_C: IC1.25(CB_6:5_C) R40.1
CB_7: IC1.21(CB_7) R73.2 R80.2
CB_8: IC1.19(CB_8) R54.2 R61.2
CB_8:7_C: D4.2(A) IC1.20(CB_8:7_C) R32.1
CB_9: IC1.16(CB_9) R45.2 R51.2
CB_10: IC1.14(CB_10) R39.2 R43.2
CB_10:9_C: D5.2(A) IC1.15(CB_10:9_C) R23.1
CB_11: IC1.11(CB_11) R29.2 R34.2
CB_12: D1.2(A) IC1.9(CB_12) R21.2 R26.2
CB_12:11_C: IC1.10(CB_12:11_C) R15.1
CB_13: IC1.6(CB_13) R12.2 R18.2
CB_14: D6.2(A) IC1.4(CB_14) R4.2 R10.2
CB_14:13_C: IC1.5(CB_14:13C) R7.1
CELL1: C73.2 R56.2 R69.2
CELL2: C67.2 R65.2 R87.1 R88.1 R89.1 R90.1
CELL3: C63.2 R48.2 R62.2
CELL4: C57.2 R57.2 R83.1 R84.1 R85.1 R86.1
CELL5: C53.2 R40.2 R52.2
CELL6: C47.2 R46.2 R73.1 R80.1 R81.1 R82.1
CELL7: C43.2 R32.2 R41.2
CELL8: C37.2 R35.2 R45.1 R51.1 R54.1 R61.1
CELL9: C33.2 R23.2 R30.2
CELL10: C27.2 R24.2 R29.1 R34.1 R39.1 R43.1
CELL11: C22.2 R15.2 R19.2
CELL12: C14.2 R12.1 R13.2 R18.1 R21.1 R26.1
CELL13: C8.2 R7.2 R8.2
CELL14: C2.2 R2.2 R4.1 R10.1
CELL_REF: C76.2 D7.2(K) D8.1(A) R71.2 R91.1 R92.1 ; port CELL_REF
CT_1: C69.1 C75.2 IC1.37(CT_1) R70.1
CT_2: C65.1 C69.2 IC1.33(CT_2) R66.1
CT_3: C59.1 C65.2 IC1.32(CT_3) R63.1
CT_4: C55.1 C59.2 IC1.28(CT_4) R58.1
CT_5: C49.1 C55.2 IC1.27(CT_5) R53.1
CT_6: C45.1 C49.2 IC1.23(CT_6) R47.1
CT_7: C39.1 C45.2 IC1.22(CT_7) R42.1
CT_8: C35.1 C39.2 IC1.18(CT_8) R36.1
CT_9: C29.1 C35.2 IC1.17(CT_9) R31.1
CT_10: C25.1 C29.2 IC1.13(CT_10) R25.1
CT_11: C16.1 C25.2 IC1.12(CT_11) R20.1
CT_12: C10.1 C16.2 IC1.8(CT_12) R14.1
CT_13: C4.1 C10.2 IC1.7(CT_13) R9.1
CT_14: C4.2 D3.1(K1) IC1.3(CT_14) R3.1
CT_REF: C75.1 C95.2 IC1.38(CT_REF) R72.1
GPIO0: C7.2 IC1.49(GPIO0) R6.1
GPIO1: C19.2 IC1.50(GPIO1) R17.1
GPIO2: C32.2 IC1.51(GPIO2) R28.1
GPIO3: C42.2 IC1.52(GPIO3) R38.1
GPIO4: C52.2 IC1.53(GPIO4) R50.1
GPIO5: C62.2 IC1.54(GPIO5) R60.1
GPIO6: C72.2 IC1.55(GPIO6) R68.1
Isense+: IC1.56(ISENSE+) ; port Isense+
Isense-: IC1.57(ISENSE-) ; port Isense-
NTC0: C5.2 R1.2 R5.2
NTC1: C17.2 R11.2 R16.2
NTC2: C30.2 R22.2 R27.2
NTC3: C40.2 R33.2 R37.2
NTC4: C50.2 R44.2 R49.2
NTC5: C60.2 R55.2 R59.2
NTC6: C70.2 R64.2 R67.2
TPL_IN+: IC1.47(SI/RDTX_IN+) ; port TPL_IN+
TPL_IN-: IC1.46(SCLK/RDXT_IN-) ; port TPL_IN-
TPL_OUT+: IC1.48(RDTX_OUT+) ; port TPL_OUT+
TPL_OUT-: IC1.45(RDTX_OUT-) ; port TPL_OUT-
VBAT: C78.2 R93.1 ; port VBAT
VCOM: C1.2 C11.2 C20.2 C21.2 C26.2 C36.2 C46.2 C56.2 C66.2 IC1.43(VCOM) R1.1 R11.1 R22.1 R33.1 R44.1 R55.1 R64.1 TP3.1
VPWR: C12.2 C13.2 D1.1(K) D2.1(K) D3.2(K2) D4.1(K) D5.1(K) D6.1(K) IC1.1(VPWR2) IC1.2(VPWR1) R93.2 TP2.1
NetC1_1: C1.1 C6.2 R5.1 R6.2
NetC3_2: C3.2 R2.1 R3.2
NetC9_2: C9.2 R8.1 R9.2
NetC11_1: C11.1 C18.2 R16.1 R17.2
NetC15_2: C15.2 R13.1 R14.2
NetC23_2: C23.2 R19.1 R20.2
NetC24_2: C24.2 IC1.60(VANA)
NetC26_1: C26.1 C31.2 R27.1 R28.2
NetC28_2: C28.2 R24.1 R25.2
NetC34_2: C34.2 R30.1 R31.2
NetC36_1: C36.1 C41.2 R37.1 R38.2
NetC38_2: C38.2 R35.1 R36.2
NetC44_2: C44.2 R41.1 R42.2
NetC46_1: C46.1 C51.2 R49.1 R50.2
NetC48_2: C48.2 R46.1 R47.2
NetC54_2: C54.2 R52.1 R53.2
NetC56_1: C56.1 C61.2 R59.1 R60.2
NetC58_2: C58.2 R57.1 R58.2
NetC64_2: C64.2 R62.1 R63.2
NetC66_1: C66.1 C71.2 R67.1 R68.2
NetC68_2: C68.2 R65.1 R66.2
NetC74_2: C74.2 R69.1 R70.2
NetC77_2: C77.2 R71.1 R72.2

Not connected (* = marked no-connect by the designer): IC1 40(FAULT)* 42(SO)* 61(SCL)* 62(SDA)*

### Channels
S1: designators end in _S1; ports CELL_REF=CELL_REF Isense+=NetIC1_S1_56 Isense-=NetIC1_S1_57 LOCAL_GND=GND_S1 TPL_IN+=RDTX_IN_S1_P TPL_IN-=RDTX_IN_S1_N TPL_OUT+=RDTX_OUT_S1_P TPL_OUT-=RDTX_OUT_S1_N VBAT=S1_VBAT
S2: designators end in _S2; ports CELL_REF=CELL_REF Isense+=NetC88_2 Isense-=NetC89_1 LOCAL_GND=GND_S1 TPL_IN+=RDTX_IN_S2_P TPL_IN-=RDTX_IN_S2_N TPL_OUT+=RDTX_OUT_S2_P TPL_OUT-=RDTX_OUT_S2_N VBAT=S2_VBAT

### Notes on the sheet
- 47nF capicator is for ESD protection and should be placed close to connector
- I2C is only used for EEPROM comms which we do not used. Fault signal is only necessary when using SPI communication instead of TPL, so not needed either.
- (near R93) 100mW !!!
- Team
- Authors
- Revision
- Title
- Project
- Subsystem
- File
- Sheet
- //

### Library data of the parts
C1 C4-C7 C10 C11 C16-C21 C24-C26 C29-C32 C35 C36 C39-C42 C45 C46 C49-C52 C55 C56 C59-C62 C65 C66 C69-C72 C75 C95 = CMP-001-01308-5: as C80 on sheet Module Board; Pins: 2; Case/Package: 0402; Category: Multilayer Ceramic Chip Capacitors; Ceramic Type: X7R
C2 C3 C8 C9 C12-C15 C22 C23 C27 C28 C33 C34 C37 C38 C43 C44 C47 C48 C53 C54 C57 C58 C63 C64 C67 C68 C73 C74 C76-C78 = CMP-001-01309-1: GTT Standard 0603 non-polarized capacitor; Voltage Rating: 100V; Tolerance: 5%; Case/Package: 0603; Category: Multilayer Ceramic Chip Capacitors; Ceramic Type: X7R; Pins: 2
D1 = CMP-1060-00445-1: Zener Voltage Regulator, 500 mW, 2-Pin SOD-123, Pb-Free, Tape and Reel; Manufacturer: On Semiconductor; VZ Typ (V): 20; P Max (W): 0.5; ComponentLink1URL: http://www.onsemi.com/; ComponentLink2URL: http://www.onsemi.com/pub_link/Collateral/MMSZ5221BT1-D.PDF; Packing: Tape and Reel; ComponentLink3URL: http://www.onsemi.com/pub_link/Collateral/425-04.PDF; ComponentLink3Description: Package Specification; Mounting Technology: Surface Mount; PartNumber: MMSZ5250BT1G; PackageDescription: 2-Pin SOD, Body 1.6 x 2.69 mm; ComponentLink2Description: Datasheet; PackageReference: SOD-123-2-425-04; ComponentLink1Description: Manufacturer URL; PackageVersion: Rev. G, 10/2009; DatasheetVersion: Rev. 12; RoHS: Pb-Free
D2 = CMP-1060-00361-1: Zener Voltage Regulator, 500 mW, 2-Pin SOD-123, Pb-Free, Tape and Reel; Manufacturer: On Semiconductor; VZ Typ (V): 75; P Max (W): 0.5; PartNumber: MMSZ5267BT1G; ComponentLink3URL: http://www.onsemi.com/pub_link/Collateral/425-04.PDF; ComponentLink1URL: http://www.onsemi.com/; ComponentLink1Description: Manufacturer URL; ComponentLink2URL: http://www.onsemi.com/pub_link/Collateral/MMSZ5221BT1-D.PDF; Packing: Tape and Reel; Mounting Technology: Surface Mount; DatasheetVersion: Rev. 12; PackageDescription: 2-Pin SOD, Body 1.6 x 2.69 mm; ComponentLink2Description: Datasheet; RoHS: Pb-Free; ComponentLink3Description: Package Specification; PackageVersion: Rev. G, 10/2009; PackageReference: SOD-123-2-425-04
D3 = CMP-004-00097-1: as D9 on sheet Module Board; Arrow Price/Stock: https://www.arrow.com/en/products/pesd5v0v1bb115/nexperia?region=nac; Design Item ID: PESD5V0V1BB,115; Height: 0.65mm; Manufacturer_Part_Number: PESD5V0V1BB,115; Mouser Price/Stock: https://www.mouser.co.uk/ProductDetail/Nexperia/PESD5V0V1BB115?qs=GcY6OjH1zdkfLKV5vNnV%252BA%3D%3D; Datasheet Link: https://assets.nexperia.com/documents/data-sheet/PESD5V0V1BB.pdf; Mouser Part Number: 771-PESD5V0V1BB115; Source: TempSchematics.schlib; Arrow Part Number: PESD5V0V1BB,115
D4 = CMP-1060-00447-1: Zener Voltage Regulator, 500 mW, 2-Pin SOD-123, Pb-Free, Tape and Reel; Manufacturer: On Semiconductor; VZ Typ (V): 43; P Max (W): 0.5; Packing: Tape and Reel; ComponentLink3URL: http://www.onsemi.com/pub_link/Collateral/425-04.PDF; DatasheetVersion: Rev. 12; ComponentLink1URL: http://www.onsemi.com/; ComponentLink3Description: Package Specification; PackageVersion: Rev. G, 10/2009; PartNumber: MMSZ5260BT1G; ComponentLink1Description: Manufacturer URL; PackageReference: SOD-123-2-425-04; ComponentLink2URL: http://www.onsemi.com/pub_link/Collateral/MMSZ5221BT1-D.PDF; Mounting Technology: Surface Mount; PackageDescription: 2-Pin SOD, Body 1.6 x 2.69 mm; RoHS: Pb-Free; ComponentLink2Description: Datasheet
D5 = CMP-1060-00319-1: Zener Voltage Regulator, 500 mW, 2-Pin SOD-123, Pb-Free, Tape and Reel; Manufacturer: On Semiconductor; P Max (W): 0.5; VZ Typ (V): 28; Mounting Technology: Surface Mount; PackageDescription: 2-Pin SOD, Body 1.6 x 2.69 mm; ComponentLink1Description: Manufacturer URL; ComponentLink2Description: Datasheet; ComponentLink2URL: http://www.onsemi.cn/pub_link/Collateral/MMSZ5221BT1-D.PDF; Packing: Tape and Reel; DatasheetVersion: Rev. 12; ComponentLink3Description: Package Specification; PackageVersion: Rev. G, 10/2009; PartNumber: SZMMSZ5255BT1G; PackageReference: SOD-123-2-425-04; ComponentLink3URL: http://www.onsemi.com/pub_link/Collateral/425-04.PDF; RoHS: Pb-Free; ComponentLink1URL: http://www.onsemi.com/
D6 = CMP-1060-00553-1: Zener Voltage Regulator, 500 mW, 2-Pin SOD-123, Pb-Free, Tape and Reel; Manufacturer: On Semiconductor; P Max (W): 0.5; VZ Typ (V): 8.2; PartNumber: MMSZ5237BT1G; DatasheetVersion: Rev. 12; ComponentLink1URL: http://www.onsemi.com/; PackageDescription: 2-Pin SOD, Body 1.6 x 2.69 mm; ComponentLink1Description: Manufacturer URL; ComponentLink2URL: http://www.onsemi.com/pub_link/Collateral/MMSZ5221BT1-D.PDF; RoHS: Pb-Free; ComponentLink3URL: http://www.onsemi.com/pub_link/Collateral/425-04.PDF; Mounting Technology: Surface Mount; PackageVersion: Rev. G, 10/2009; ComponentLink2Description: Datasheet; ComponentLink3Description: Package Specification; Packing: Tape and Reel; PackageReference: SOD-123-2-425-04
D7 D8 = CMP-004-00003-1: Schottky Power Rectifier, 20 V, 5.5 A, -65 to 125 degC, 2-Pin SMD, RoHS, Tape and Reel; Manufacturer: ON Semiconductor; Peak Reverse Current: 250uA; Max Surge Current: 5.5A; Forward Voltage: 3.85dV; Forward Current: 5dA; Elements: 1; Datasheet Version: Rev. 6, 01/2012; Max Operating Temperature: 125°C; RoHS Compliant: True; Manufacturer URL: http://www.onsemi.com/; Packaging: TapeandReel; Datasheet URL: http://www.onsemi.cn/pub_link/Collateral/MBR0520LT1-D.PDF; Package Reference: SOD-123-2-425-04; Package Quantity: 3000; Min Operating Temperature: -65°C; Mounting Technology: SM; Package Description: 2-Pin Surface Mount Device, Body 2.69 x 1.6 mm; Case/Package: SOD; Pins: 2
IC1 = CMP-031-00033-2: Integrated Circuit; Manufacturer_Name: NXP; Design Item ID: MC33771CTP1AE; Arrow Part Number: MC33771CTP1AE; Mouser Price/Stock: https://www.mouser.co.uk/ProductDetail/NXP-Semiconductors/MC33771CTP1AE?qs=wnTfsH77Xs56aES1BMo%252B4w%3D%3D; Arrow Price/Stock: https://www.arrow.com/en/products/mc33771ctp1ae/nxp-semiconductors?region=europe; Height: 1.6mm; Source: TempSchematics.schlib; Datasheet Link: https://eu.mouser.com/datasheet/2/302/PB_MC33771C-1949877.pdf; Manufacturer_Part_Number: MC33771CTP1AE; Mouser Part Number: 771-MC33771CTP1AE
R1-R3 R5-R9 R11 R13-R17 R19 R20 R22-R25 R27 R28 R30-R33 R35-R38 R40-R42 R44 R46-R50 R52 R53 R55-R60 R62-R72 = CMP-009-00204-16: as R74 on sheet Module Board; Case/Package: 0402; Mounting Technology: SMD; Design Item ID: RES 0402; Source: Passives.SchLib; Tolerance: 1%
R4 R10 R12 R18 R21 R26 R29 R34 R39 R43 R45 R51 R54 R61 R73 R80-R93 = CMP-009-00208-2: GTT Standard 1206 Resistor; Voltage Rating: 50V; Power: 250mW; Mounting Technology: SMD; Tolerance: 1%; Case/Package: 1206
TP1-TP3 = CMP-00030-00001-6: Design Item ID: GTT_ProbeerPunt; Source: GTT_MainComponentLibrary.SchLib

## Nets that join several sheets
GND_S1: Module Board (40 pins), S1 (70 pins), S2 (70 pins)
CELL_REF: Module Board (P2.1), S1 (6 pins)
CELL_REF: Module Board (P5.1), S2 (6 pins)
NetC88_2: Module Board (C88.2 C89.2 R76.2 R94.2), S2 (IC1_S2.56)
NetC89_1: Module Board (C89.1 C91.2 R78.2 R95.2), S2 (IC1_S2.57)
NetIC1_S1_56: Module Board (NT1.1), S1 (IC1_S1.56)
NetIC1_S1_57: Module Board (NT2.1), S1 (IC1_S1.57)
RDTX_IN_S1_N: Module Board (C81.2 D10.2 T1.6), S1 (IC1_S1.46)
RDTX_IN_S1_P: Module Board (C80.2 D9.2 T1.4), S1 (IC1_S1.47)
RDTX_IN_S2_N: Module Board (C86.2 T2.4), S2 (IC1_S2.46)
RDTX_IN_S2_P: Module Board (C85.2 T2.6), S2 (IC1_S2.47)
RDTX_OUT_S1_N: Module Board (C84.2 T2.3), S1 (IC1_S1.45)
RDTX_OUT_S1_P: Module Board (C83.2 T2.1), S1 (IC1_S1.48)
RDTX_OUT_S2_N: Module Board (C92.2 D15.2 T3.6), S2 (IC1_S2.45)
RDTX_OUT_S2_P: Module Board (C93.2 D14.2 T3.4), S2 (IC1_S2.48)
S1_VBAT: Module Board (P2.17), S1 (C78_S1.2 R93_S1.1)
S2_VBAT: Module Board (P5.17), S2 (C78_S2.2 R93_S2.1)